# Altium schematic sheet Interface Connector.SchDoc
size A4; Author: Thomas Kreppel; CompanyName: Universidad de Santiago de Chile; Address1: Avenida Ecuador Nº 3519; Address2: Estación Central, Santiago; Address3: Chile; DocumentNumber: 2; SheetNumber: 2; SheetTotal: 6
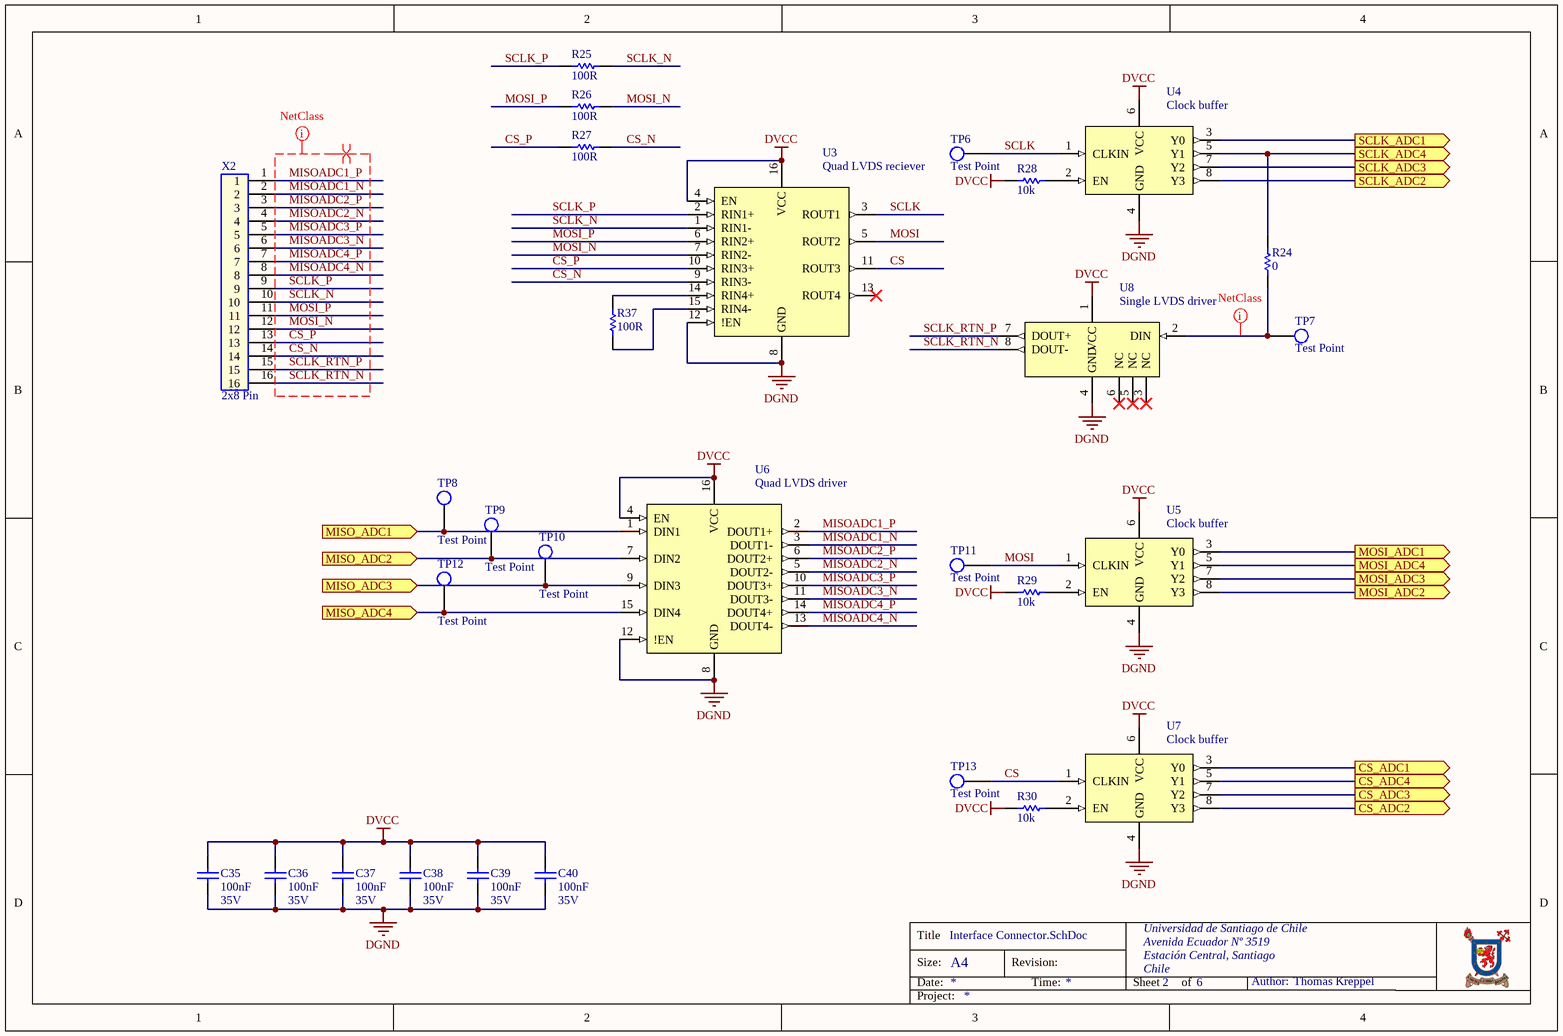
[diagram p0: Interface Connector.SchDoc]

## Parts
C35  100nF  Voltage: 35V  [CAP_0603]
C36  100nF  Voltage: 35V  [CAP_0603]
C37  100nF  Voltage: 35V  [CAP_0603]
C38  100nF  Voltage: 35V  [CAP_0603]
C39  100nF  Voltage: 35V  [CAP_0603]
C40  100nF  Voltage: 35V  [CAP_0603]
R24  0  [RES_0603]
R25  100R  [RES_0603]
R26  100R  [RES_0603]
R27  100R  [RES_0603]
R28  10k  [RES_0603]
R29  10k  [RES_0603]
R30  10k  [RES_0603]
R37  100R  [RES_0603]
TP6  Test Point  [TP_1.6mm]  (no BOM)
TP7  Test Point  [TP_1.6mm]  (no BOM)
TP8  Test Point  [TP_1.6mm]  (no BOM)
TP9  Test Point  [TP_1.6mm]  (no BOM)
TP10  Test Point  [TP_1.6mm]  (no BOM)
TP11  Test Point  [TP_1.6mm]  (no BOM)
TP12  Test Point  [TP_1.6mm]  (no BOM)
TP13  Test Point  [TP_1.6mm]  (no BOM)
U3  Quad LVDS reciever  [TSOP65P640X120-16N]
U4  Clock buffer  [TSOP65P640X120-8N]
U5  Clock buffer  [TSOP65P640X120-8N]
U6  Quad LVDS driver  [TSOP65P640X120-16N]
U7  Clock buffer  [TSOP65P640X120-8N]
U8  Single LVDS driver  [SOIC127P600X170_HS-9N_no_THP]
X2  2x8 Pin  [EHF-108-01-F-D]

## Ports
CS_ADC1 (out), CS_ADC2 (out), CS_ADC3 (out), CS_ADC4 (out), MISO_ADC1 (in), MISO_ADC2 (in), MISO_ADC3 (in), MISO_ADC4 (in), MOSI_ADC1 (out), MOSI_ADC2 (out), MOSI_ADC3 (out), MOSI_ADC4 (out), SCLK_ADC1 (out), SCLK_ADC2 (out), SCLK_ADC3 (out), SCLK_ADC4 (out)

## Nets
DGND: C35.2 C36.2 C37.2 C38.2 C39.2 C40.2 U3.8(GND) U3.12(!EN) U4.4(GND) U5.4(GND) U6.8(GND) U6.12(!EN) U7.4(GND) U8.4(GND)
DVCC: C35.1 C36.1 C37.1 C38.1 C39.1 C40.1 R28.2 R29.2 R30.2 U3.4(EN) U3.16(VCC) U4.6(VCC) U5.6(VCC) U6.4(EN) U6.16(VCC) U7.6(VCC) U8.1(VCC)
CS: TP13.1 U3.11(ROUT3) U7.1(CLKIN)
CS_ADC1: U7.3(Y0) ; port CS_ADC1
CS_ADC2: U7.8(Y3) ; port CS_ADC2
CS_ADC3: U7.7(Y2) ; port CS_ADC3
CS_ADC4: U7.5(Y1) ; port CS_ADC4
CS_N: R27.1 U3.9(RIN3-) X2.14
CS_P: R27.2 U3.10(RIN3+) X2.13
MISO_ADC1: TP8.1 U6.1(DIN1) ; port MISO_ADC1
MISO_ADC2: TP9.1 U6.7(DIN2) ; port MISO_ADC2
MISO_ADC3: TP10.1 U6.9(DIN3) ; port MISO_ADC3
MISO_ADC4: TP12.1 U6.15(DIN4) ; port MISO_ADC4
MISOADC1_N: U6.3(DOUT1-) X2.2
MISOADC1_P: U6.2(DOUT1+) X2.1
MISOADC2_N: U6.5(DOUT2-) X2.4
MISOADC2_P: U6.6(DOUT2+) X2.3
MISOADC3_N: U6.11(DOUT3-) X2.6
MISOADC3_P: U6.10(DOUT3+) X2.5
MISOADC4_N: U6.13(DOUT4-) X2.8
MISOADC4_P: U6.14(DOUT4+) X2.7
MOSI: TP11.1 U3.5(ROUT2) U5.1(CLKIN)
MOSI_ADC1: U5.3(Y0) ; port MOSI_ADC1
MOSI_ADC2: U5.8(Y3) ; port MOSI_ADC2
MOSI_ADC3: U5.7(Y2) ; port MOSI_ADC3
MOSI_ADC4: U5.5(Y1) ; port MOSI_ADC4
MOSI_N: R26.1 U3.7(RIN2-) X2.12
MOSI_P: R26.2 U3.6(RIN2+) X2.11
SCLK: TP6.1 U3.3(ROUT1) U4.1(CLKIN)
SCLK_ADC1: U4.3(Y0) ; port SCLK_ADC1
SCLK_ADC2: U4.8(Y3) ; port SCLK_ADC2
SCLK_ADC3: U4.7(Y2) ; port SCLK_ADC3
SCLK_ADC4: R24.1 U4.5(Y1) ; port SCLK_ADC4
SCLK_N: R25.1 U3.1(RIN1-) X2.10
SCLK_P: R25.2 U3.2(RIN1+) X2.9
SCLK_RTN_N: U8.8(DOUT-) X2.16
SCLK_RTN_P: U8.7(DOUT+) X2.15
NetR24_2: R24.2 TP7.1 U8.2(DIN)
NetR28_1: R28.1 U4.2(EN)
NetR29_1: R29.1 U5.2(EN)
NetR30_1: R30.1 U7.2(EN)
NetR37_1: R37.1 U3.15(RIN4-)
NetR37_2: R37.2 U3.14(RIN4+)

Not connected (* = marked no-connect by the designer): U3 13(ROUT4)*; U8 3(NC)* 5(NC)* 6(NC)*

## Layout directives
differential pair: CS_N, CS_P, MISOADC1_N, MISOADC1_P, MISOADC2_N, MISOADC2_P, MISOADC3_N, MISOADC3_P, MISOADC4_N, MISOADC4_P, MOSI_N, MOSI_P, SCLK_N, SCLK_P, SCLK_RTN_N, SCLK_RTN_P
net class Match_diff: CS_N, CS_P, MISOADC1_N, MISOADC1_P, MISOADC2_N, MISOADC2_P, MISOADC3_N, MISOADC3_P, MISOADC4_N, MISOADC4_P, MOSI_N, MOSI_P, SCLK_N, SCLK_P, SCLK_RTN_N, SCLK_RTN_P
net class Match_single: NetR24_2

## Notes on the sheet
- Title
- Size:
- Date:
- A4
- Revision:
- Time:
- Sheet
- of
- Author:
- Project:

## Library data of the parts
C35-C40 = Cap_0603: Capacitor; MPN: C0603C104M5RACTU; Rule: PcbType=ProtelPcb; MF: KEMET; Dielectricum: X7R; Tolerance: 10%; Published: 8-Jun-2000; LatestRevisionDate: 17-Jul-2002; LatestRevisionNote: Re-released for DXP Platform.; PackageReference: RAD-0.3; Publisher: Altium Limited; Value: 100nF; Supplier Part Number 1: 399-7845-1-ND; Supplier 1: Digikey; Package: 0603; LCSC Part Number: C14663
R24 = Res0603: Tolerance: 1%; Published: 8-Jun-2000; LatestRevisionDate: 17-Jul-2002; LatestRevisionNote: Re-released for DXP Platform.; PackageReference: AXIAL-0.3; Publisher: Altium Limited; PackageDescription: Axial Device, Thru-Hole; 2 Leads; 0.3 in Pin Spacing; Supplier Part Number 1: 311-0.0GRCT-ND; Value: 0; Supplier 1: Digikey; Package: 0603
R25-R27 R37 = Res0603: MPN: RC0603FR-07100RL; MF: Yageo; Tolerance: 1%; Published: 8-Jun-2000; LatestRevisionDate: 17-Jul-2002; LatestRevisionNote: Re-released for DXP Platform.; PackageReference: AXIAL-0.3; Publisher: Altium Limited; PackageDescription: Axial Device, Thru-Hole; 2 Leads; 0.3 in Pin Spacing; Supplier Part Number 1: 311-100HRCT-ND; Value: 100R; Supplier 1: Digikey; Package: 0603; LCSC Part Number: C22775
R28-R30 = Res0603: MPN: RC0603FR-0710KL; MF: Yageo; Tolerance: 1%; Published: 8-Jun-2000; LatestRevisionDate: 17-Jul-2002; LatestRevisionNote: Re-released for DXP Platform.; PackageReference: AXIAL-0.3; Publisher: Altium Limited; PackageDescription: Axial Device, Thru-Hole; 2 Leads; 0.3 in Pin Spacing; Value: 10k; Supplier Part Number 1: 311-10.0KHRCT-ND; Supplier 1: Digikey; Package: 0603
  R29 R30: Digikey Part-Number: 311-10.0KHRCT-ND
TP6-TP13 = TP: 1.6mm Test Point Keystone; MPN: 5006; MF: Keystone Electronics; Created: 2020_04_Kreppel; Supplier 1: Digikey; Supplier Part Number 1: 36-5006-ND
U3 = ADN4666: 3V, LVDS, quad, CMOS Differential Line Receiver; MPN: ADN4666ARUZ; MF: Analog Devices; Created: 2020_05_Kreppel; Supplier 1: Digikey; Supplier Part Number 1: ADN4666ARUZ-ND; LCSC Part Number: C658631
U4 U5 U7 = CDCV304: 1:4 200MHz LVCMOS clock buffer, general-purpose, PCI-X Compliant; MPN: CDCV304PWRG4; MF: Texas Instruments; Created: 2020_05_Kreppel; Supplier 1: Digikey; Supplier Part Number 1: 296-35899-1-ND; LCSC Part Number: C2649343
U6 = ADN4665: 3V, LVDS, Quad, CMOS Differential Line Driver; MPN: ADN4665ARUZ; MF: Analog Devices; Created: 2020_05_Kreppel; Supplier 1: Digikey; Supplier Part Number 1: ADN4665ARUZ-ND; LCSC Part Number: C658627
U8 = ADN4661: Single, 3V, CMOS, LVDS High Speed differential driver; MPN: ADN4661BRZ; MF: Analog Devices; Created: 2020_05_Kreppel; Supplier 1: Digikey; Supplier Part Number 1: ADN4661BRZ-ND; LCSC Part Number: C658621
X2 = EHF-108-01-F-D: Dual Row, 2x8 Shrouded IDC Header with Ejectors 50 mil pitch; MF: Samtec; Created: 2020_05_Kreppel; MPN: EHF-108-01-F-D; Supplier 1: Digikey; Supplier Part Number 1: SAM9265-ND; LCSC Part Number: C17569033